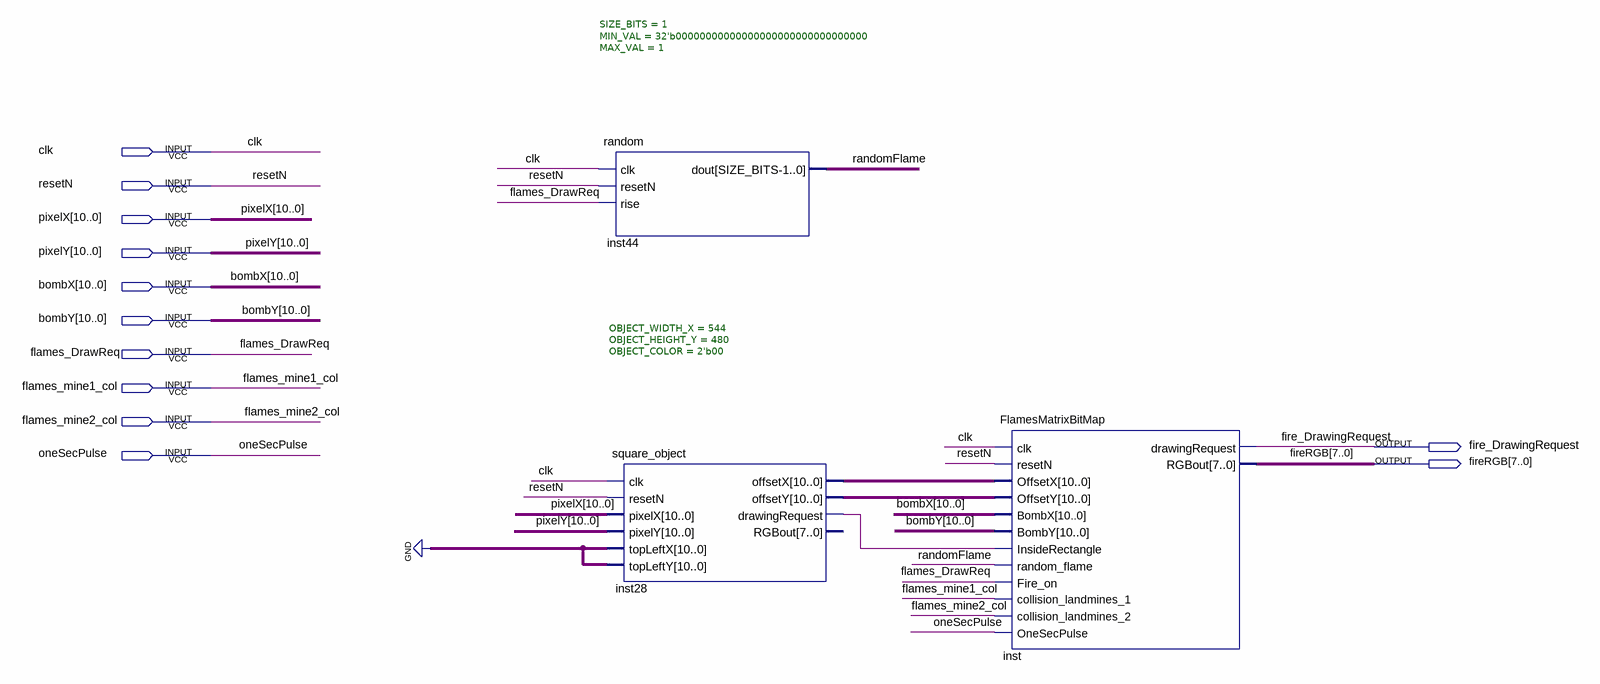
[diagram p0: schematic sheet]
// Quartus schematic FLAMES_DISPLAY.bdf as structural Verilog: 3 symbols, 12 pins
module FLAMES_DISPLAY (
  input  clk,
  input  resetN,
  input  [10:0] pixelX,
  input  [10:0] pixelY,
  input  [10:0] bombX,
  input  [10:0] bombY,
  input  flames_DrawReq,
  input  flames_mine1_col,
  input  flames_mine2_col,
  input  oneSecPulse,
  output fire_DrawingRequest,
  output [7:0] fireRGB
);

  wire inst28_drawingrequest, randomFlame;
  wire [10:0] inst28_offsetx, inst28_offsety;

  random #(.SIZE_BITS(1), .MIN_VAL(32'b00000000000000000000000000000000), .MAX_VAL(1)) inst44 (
    .clk(clk), .resetN(resetN), .rise(flames_DrawReq), .dout(randomFlame));
  square_object #(.OBJECT_WIDTH_X(544), .OBJECT_HEIGHT_Y(480), .OBJECT_COLOR(2'b00)) inst28 (
    .clk(clk), .resetN(resetN), .pixelX(pixelX), .pixelY(pixelY), .topLeftX({11{1'b0}}),
    .topLeftY({11{1'b0}}), .offsetX(inst28_offsetx), .offsetY(inst28_offsety),
    .drawingRequest(inst28_drawingrequest));  // open: RGBout
  FlamesMatrixBitMap inst (
    .clk(clk), .resetN(resetN), .OffsetX(inst28_offsetx), .OffsetY(inst28_offsety), .BombX(bombX),
    .BombY(bombY), .InsideRectangle(inst28_drawingrequest), .random_flame(randomFlame),
    .Fire_on(flames_DrawReq), .collision_landmines_1(flames_mine1_col),
    .collision_landmines_2(flames_mine2_col), .OneSecPulse(oneSecPulse),
    .drawingRequest(fire_DrawingRequest), .RGBout(fireRGB));
endmodule
